# Altium schematic sheet Top_Level.SchDoc
size A
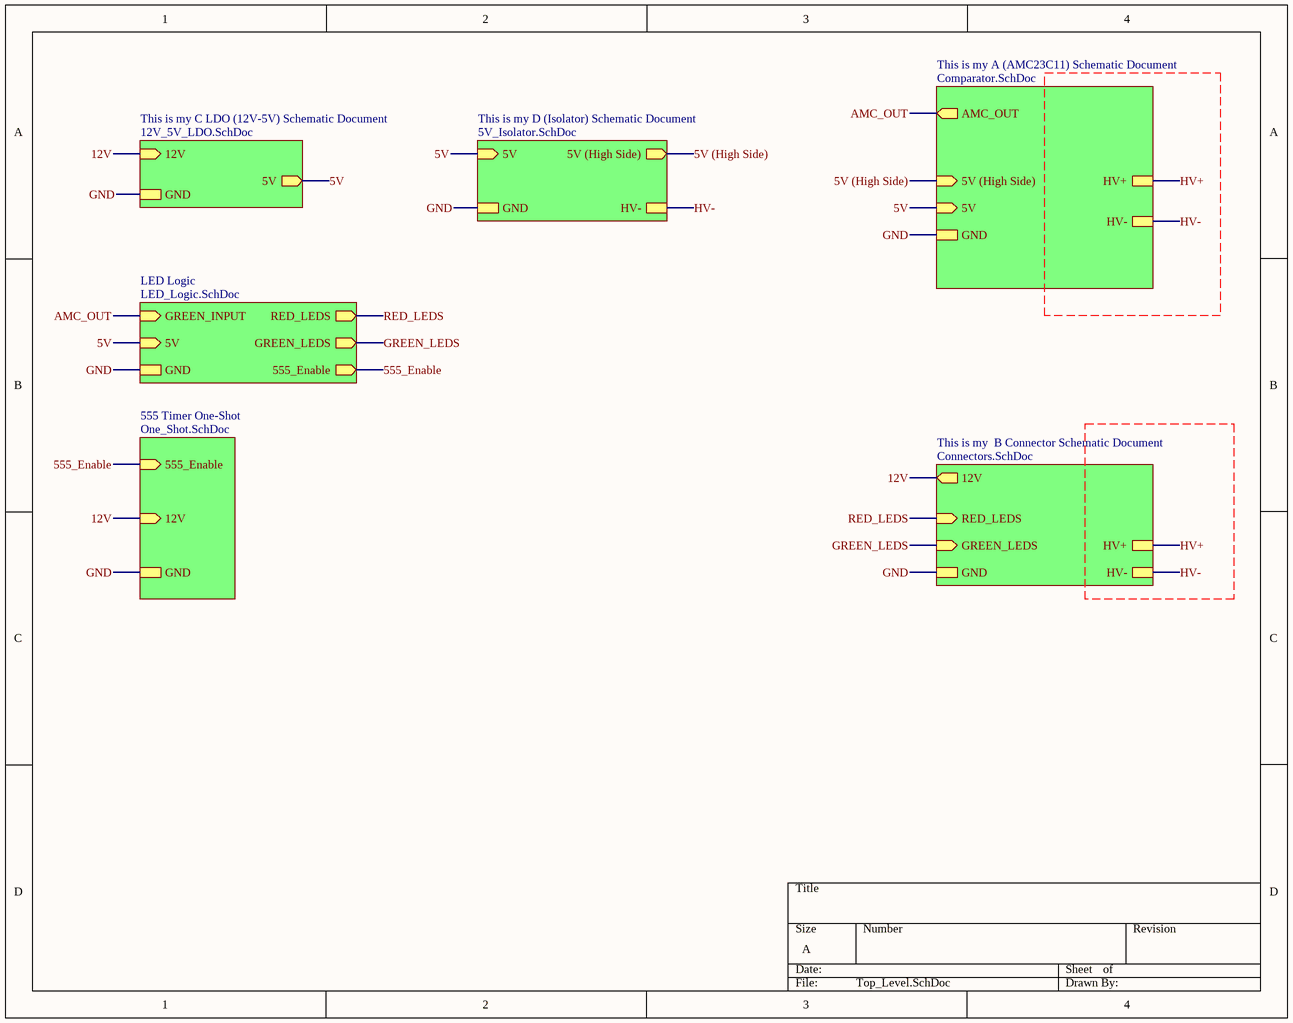
[diagram p0: Top_Level.SchDoc]

## Sub-sheets
555 Timer One-Shot = One_Shot.SchDoc: 555_Enable (in), 12V (in), GND
LED Logic = LED_Logic.SchDoc: GREEN_INPUT (in), 5V (in), RED_LEDS (out), GREEN_LEDS (out), GND, 555_Enable (out)
This is my  B Connector Schematic Document = Connectors.SchDoc: 12V (out), HV-, RED_LEDS (in), GREEN_LEDS (in), GND, HV+
This is my A (AMC23C11) Schematic Document = Comparator.SchDoc: 5V (High Side) (in), 5V (in), HV-, AMC_OUT (out), GND, HV+
This is my C LDO (12V-5V) Schematic Document = 12V_5V_LDO.SchDoc: 12V (in), 5V (out), GND
This is my D (Isolator) Schematic Document = 5V_Isolator.SchDoc: 5V (in), GND, 5V (High Side) (out), HV-

## Nets
5V: sheet This is my A (AMC23C11) Schematic Document/5V, sheet This is my C LDO (12V-5V) Schematic Document/5V, sheet This is my D (Isolator) Schematic Document/5V, sheet LED Logic/5V
5V (High Side): sheet This is my A (AMC23C11) Schematic Document/5V (High Side), sheet This is my D (Isolator) Schematic Document/5V (High Side)
12V: sheet This is my  B Connector Schematic Document/12V, sheet This is my C LDO (12V-5V) Schematic Document/12V, sheet 555 Timer One-Shot/12V
555_Enable: sheet LED Logic/555_Enable, sheet 555 Timer One-Shot/555_Enable
AMC_OUT: sheet This is my A (AMC23C11) Schematic Document/AMC_OUT, sheet LED Logic/GREEN_INPUT
GND: sheet This is my A (AMC23C11) Schematic Document/GND, sheet This is my  B Connector Schematic Document/GND, sheet This is my C LDO (12V-5V) Schematic Document/GND, sheet This is my D (Isolator) Schematic Document/GND, sheet LED Logic/GND, sheet 555 Timer One-Shot/GND
GREEN_LEDS: sheet This is my  B Connector Schematic Document/GREEN_LEDS, sheet LED Logic/GREEN_LEDS
HV+: sheet This is my A (AMC23C11) Schematic Document/HV+, sheet This is my  B Connector Schematic Document/HV+
HV-: sheet This is my A (AMC23C11) Schematic Document/HV-, sheet This is my  B Connector Schematic Document/HV-, sheet This is my D (Isolator) Schematic Document/HV-
RED_LEDS: sheet This is my  B Connector Schematic Document/RED_LEDS, sheet LED Logic/RED_LEDS